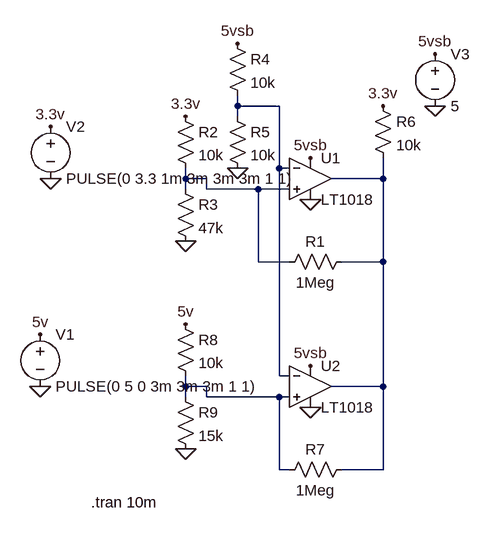
[diagram p0: schematic 5v_3v_voltage_supervisor.asc]
5v_3v_voltage_supervisor.asc, the LTspice schematic file:
Version 4
SHEET 1 880 692
WIRE 48 64 48 48
WIRE 112 64 48 64
WIRE 48 80 48 64
WIRE 112 160 112 64
WIRE 128 160 112 160
WIRE -32 176 -32 160
WIRE 0 176 -32 176
WIRE 272 176 272 144
WIRE 272 176 192 176
WIRE -32 192 -32 176
WIRE 0 192 0 176
WIRE 80 192 0 192
WIRE 128 192 80 192
WIRE 80 304 80 192
WIRE 128 304 80 304
WIRE 272 304 272 176
WIRE 272 304 208 304
WIRE 112 480 112 160
WIRE 128 480 112 480
WIRE -32 496 -32 480
WIRE 0 496 -32 496
WIRE 272 496 272 304
WIRE 272 496 192 496
WIRE -32 512 -32 496
WIRE 0 512 0 496
WIRE 112 512 0 512
WIRE 128 512 112 512
WIRE 112 624 112 512
WIRE 128 624 112 624
WIRE 272 624 272 496
WIRE 272 624 208 624
FLAG 352 -16 5vsb
FLAG 160 144 5vsb
FLAG -256 416 5v
FLAG -240 96 3.3v
FLAG -240 176 0
FLAG -256 496 0
FLAG 352 64 0
FLAG 160 208 0
FLAG 48 160 0
FLAG -32 272 0
FLAG -32 80 3.3v
FLAG 48 -32 5vsb
FLAG 272 64 3.3v
FLAG 160 464 5vsb
FLAG 160 528 0
FLAG -32 592 0
FLAG -32 400 5v
SYMBOL Comparators\\LT1018 160 176 R0
SYMATTR InstName U1
SYMBOL voltage -256 400 R0
WINDOW 123 0 0 Left 0
WINDOW 39 0 0 Left 0
SYMATTR InstName V1
SYMATTR Value PULSE(0 5 0 3m 3m 3m 1 1)
SYMBOL voltage -240 80 R0
WINDOW 123 0 0 Left 0
WINDOW 39 0 0 Left 0
SYMATTR InstName V2
SYMATTR Value PULSE(0 3.3 1m 3m 3m 3m 1 1)
SYMBOL voltage 352 -32 R0
SYMATTR InstName V3
SYMATTR Value 5
SYMBOL res 224 288 R90
WINDOW 0 0 56 VBottom 2
WINDOW 3 32 56 VTop 2
SYMATTR InstName R1
SYMATTR Value 1Meg
SYMBOL res -48 64 R0
SYMATTR InstName R2
SYMATTR Value 10k
SYMBOL res -48 176 R0
SYMATTR InstName R3
SYMATTR Value 47k
SYMBOL res 32 -48 R0
SYMATTR InstName R4
SYMATTR Value 10k
SYMBOL res 32 64 R0
SYMATTR InstName R5
SYMATTR Value 10k
SYMBOL res 256 48 R0
SYMATTR InstName R6
SYMATTR Value 10k
SYMBOL Comparators\\LT1018 160 496 R0
SYMATTR InstName U2
SYMBOL res 224 608 R90
WINDOW 0 0 56 VBottom 2
WINDOW 3 32 56 VTop 2
SYMATTR InstName R7
SYMATTR Value 1Meg
SYMBOL res -48 384 R0
SYMATTR InstName R8
SYMATTR Value 10k
SYMBOL res -48 496 R0
SYMATTR InstName R9
SYMATTR Value 15k
TEXT -178 674 Left 2 !.tran 10m

The netlist it stands for:
* 5v_3v_voltage_supervisor.asc
XU1 N002 N001 5vsb 0 N003 LT1018  ; pins In+ In- V+ V- OUT
V1 5v 0 PULSE(0 5 0 3m 3m 3m 1 1)
V2 3.3v 0 PULSE(0 3.3 1m 3m 3m 3m 1 1)
V3 5vsb 0 5
R1 N003 N002 1Meg
R2 3.3v N002 10k
R3 N002 0 47k
R4 5vsb N001 10k
R5 N001 0 10k
R6 3.3v N003 10k
XU2 N004 N001 5vsb 0 N003 LT1018  ; pins In+ In- V+ V- OUT
R7 N003 N004 1Meg
R8 5v N004 10k
R9 N004 0 15k
.tran 10m
.lib LTC1.lib
.backanno
.end